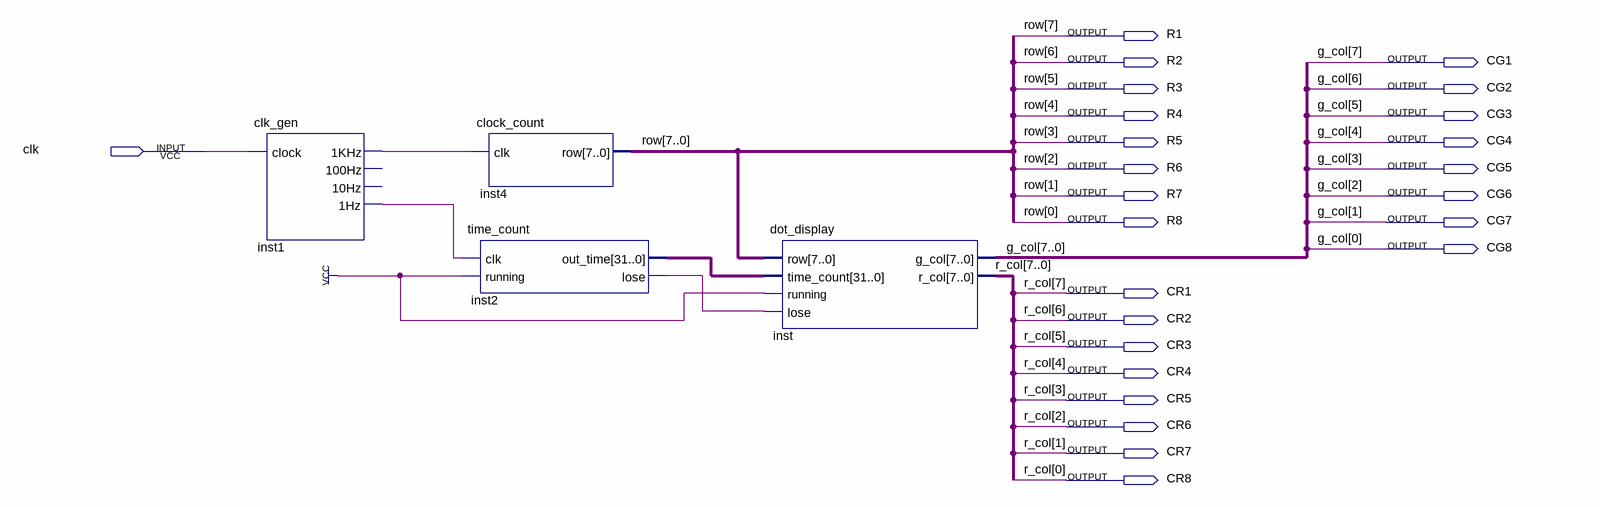
[diagram p0: schematic sheet]
// Quartus schematic dot_matrix_display.bdf as structural Verilog: 4 symbols, 25 pins
module dot_matrix_display (
  input  clk,
  output R1,
  output R2,
  output CG1,
  output R3,
  output CG2,
  output R4,
  output CG3,
  output R5,
  output CG4,
  output R6,
  output CG5,
  output R7,
  output CG6,
  output R8,
  output CG7,
  output CG8,
  output CR1,
  output CR2,
  output CR3,
  output CR4,
  output CR5,
  output CR6,
  output CR7,
  output CR8
);

  wire inst1_1hz, inst1_1khz, inst2_lose;
  wire [31:0] inst2_out_time;

  clk_gen inst1 (.clock(clk), .\1KHz (inst1_1khz), .\1Hz (inst1_1hz));  // open: 100Hz, 10Hz
  clock_count inst4 (.clk(inst1_1khz), .row({R1, R2, R3, R4, R5, R6, R7, R8}));
  time_count inst2 (.clk(inst1_1hz), .running(1'b1), .out_time(inst2_out_time), .lose(inst2_lose));
  dot_display inst (
    .row({R1, R2, R3, R4, R5, R6, R7, R8}), .time_count(inst2_out_time), .running(1'b1), .lose(inst2_lose),
    .g_col({CG1, CG2, CG3, CG4, CG5, CG6, CG7, CG8}), .r_col({CR1, CR2, CR3, CR4, CR5, CR6, CR7, CR8}));

  // Other names for the same wires on the sheet: g_col[7:0] = {CG1, CG2, CG3, CG4, CG5, CG6, CG7, CG8};
  //   r_col[7:0] = {CR1, CR2, CR3, CR4, CR5, CR6, CR7, CR8}; row[7:0] = {R1, R2, R3, R4, R5, R6, R7, R8}
endmodule
